# Altium schematic sheet Driver.SchDoc: Blood Flow Phantom
size A4; ApprovedBy: Sergei Vostrikov; CheckedBy: Sergei Vostrikov; Author: Ilia Nazemtsev; CompanyName: ETH Zurich; DrawnBy: Ilia Nazemtsev; Organization: Integrated Systems Laboratory; Address1: Gloriastrasse 35; Address2: 8092 Zurich; Address3: ETZ J69; Revision: 1.0; SheetNumber: 2; SheetTotal: 3; Laboratory: Integrated Systems Laboratory
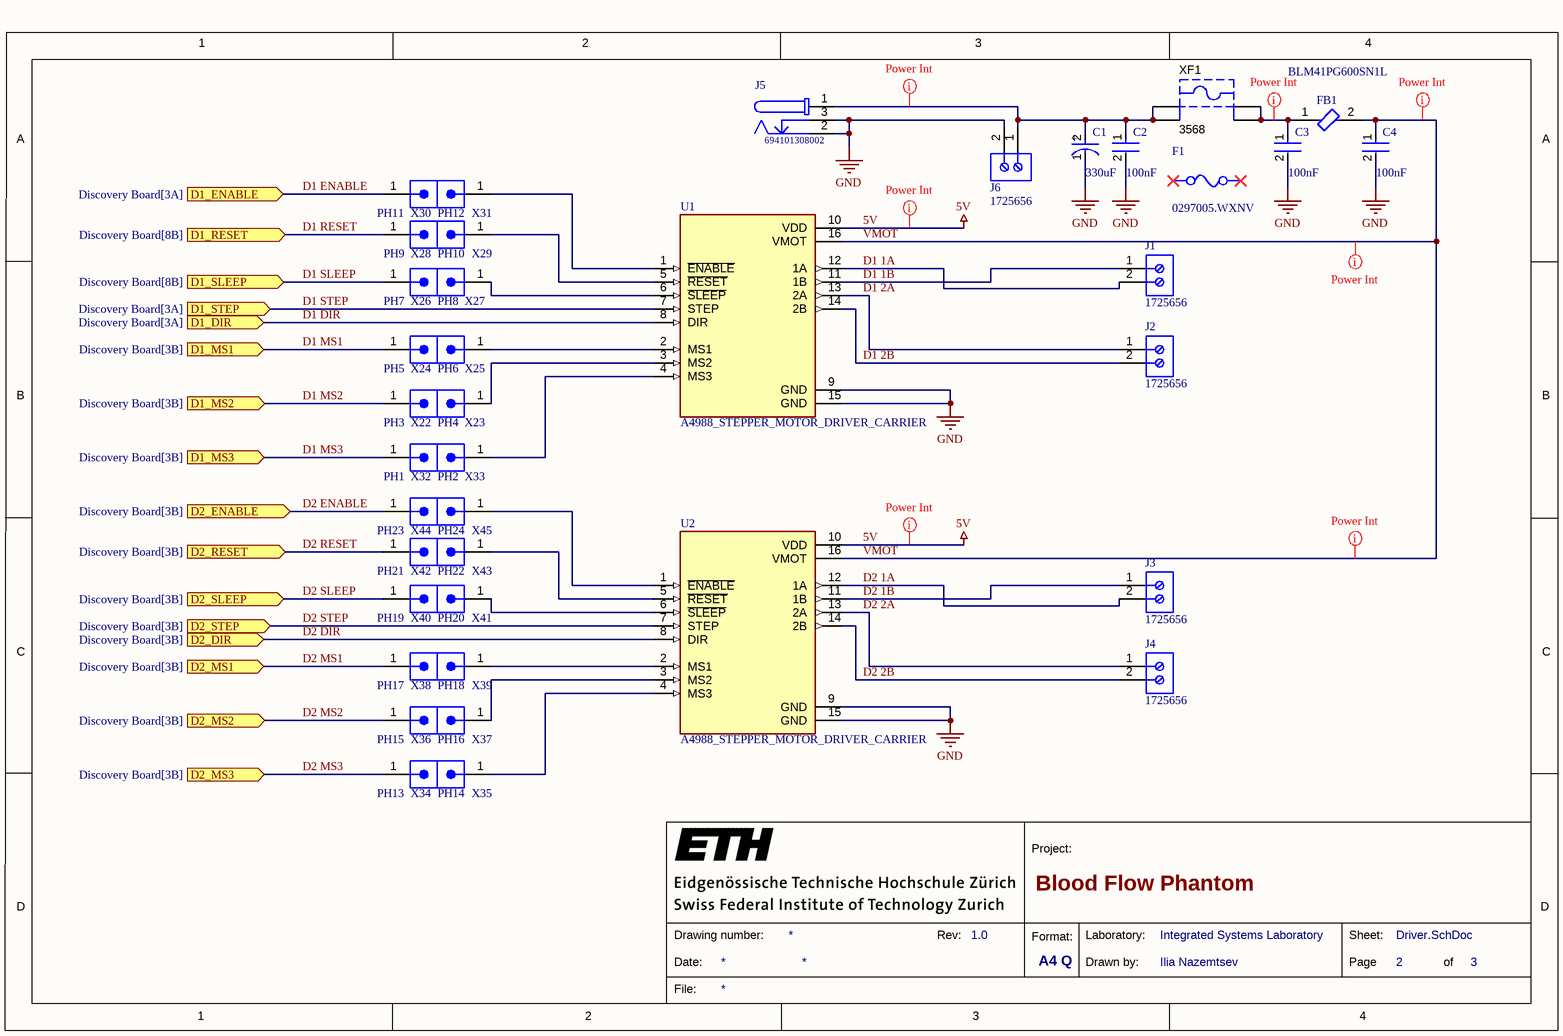
[diagram p0: Driver.SchDoc]

## Parts
C1  330uF  [FP-RAD-TH-D_10_0_5-L_12_5-MFG]
C2  100nF  [FP-CL31-IPC_C]
C3  100nF  [FP-CL31-IPC_C]
C4  100nF  [FP-CL31-IPC_C]
F1  0297005.WXNV  [FP-0297-MFG]
FB1  BLM41PG600SN1L  [FP-BLM41-0_2-IPC_B]
J1  1725656  [PHOE-1725656-2]
J2  1725656  [PHOE-1725656-2]
J3  1725656  [PHOE-1725656-2]
J4  1725656  [PHOE-1725656-2]
J5  694101308002  [694101308002]
J6  1725656  [PHOE-1725656-2]
U1  A4988_STEPPER_MOTOR_DRIVER_CARRIER  [MODULE_A4988_STEPPER_MOTOR_DRIVER_CARRIER]
U2  A4988_STEPPER_MOTOR_DRIVER_CARRIER  [MODULE_A4988_STEPPER_MOTOR_DRIVER_CARRIER]
X22  PH3  [68000-101HLF]
X23  PH4  [68000-101HLF]
X24  PH5  [68000-101HLF]
X25  PH6  [68000-101HLF]
X26  PH7  [68000-101HLF]
X27  PH8  [68000-101HLF]
X28  PH9  [68000-101HLF]
X29  PH10  [68000-101HLF]
X30  PH11  [68000-101HLF]
X31  PH12  [68000-101HLF]
X32  PH1  [68000-101HLF]
X33  PH2  [68000-101HLF]
X34  PH13  [68000-101HLF]
X35  PH14  [68000-101HLF]
X36  PH15  [68000-101HLF]
X37  PH16  [68000-101HLF]
X38  PH17  [68000-101HLF]
X39  PH18  [68000-101HLF]
X40  PH19  [68000-101HLF]
X41  PH20  [68000-101HLF]
X42  PH21  [68000-101HLF]
X43  PH22  [68000-101HLF]
X44  PH23  [68000-101HLF]
X45  PH24  [68000-101HLF]
XF1  3568  [KSTN-3568_V]

## Ports
D1_DIR (in, see Discovery Board[3A]), D1_ENABLE (in, see Discovery Board[3A]), D1_MS1 (in, see Discovery Board[3B]), D1_MS2 (in, see Discovery Board[3B]), D1_MS3 (in, see Discovery Board[3B]), D1_RESET (in, see Discovery Board[8B]), D1_SLEEP (in, see Discovery Board[8B]), D1_STEP (in, see Discovery Board[3A]), D2_DIR (in, see Discovery Board[3B]), D2_ENABLE (in, see Discovery Board[3B]), D2_MS1 (in, see Discovery Board[3B]), D2_MS2 (in, see Discovery Board[3B]), D2_MS3 (in, see Discovery Board[3B]), D2_RESET (in, see Discovery Board[3B]), D2_SLEEP (in, see Discovery Board[3B]), D2_STEP (in, see Discovery Board[3B])

## Nets
5V: U1.10(VDD) U2.10(VDD)
GND: C1.1(C) C2.2 C3.2 C4.2 J5.2 J5.3 J6.2 U1.9(GND) U1.15(GND) U2.9(GND) U2.15(GND)
D1 1A: J1.2 U1.12(1A)
D1 1B: J1.1 U1.11(1B)
D1 2A: J2.1 U1.13(2A)
D1 2B: J2.2 U1.14(2B)
D1 DIR: U1.8(DIR) ; port D1_DIR
D1 ENABLE: X30.1 ; port D1_ENABLE
D1 MS1: X24.1 ; port D1_MS1
D1 MS2: X22.1 ; port D1_MS2
D1 MS3: X32.1 ; port D1_MS3
D1 RESET: X28.1 ; port D1_RESET
D1 SLEEP: X26.1 ; port D1_SLEEP
D1 STEP: U1.7(STEP) ; port D1_STEP
D2 1A: J3.2 U2.12(1A)
D2 1B: J3.1 U2.11(1B)
D2 2A: J4.1 U2.13(2A)
D2 2B: J4.2 U2.14(2B)
D2 DIR: U2.8(DIR) ; port D2_DIR
D2 ENABLE: X44.1 ; port D2_ENABLE
D2 MS1: X38.1 ; port D2_MS1
D2 MS2: X36.1 ; port D2_MS2
D2 MS3: X34.1 ; port D2_MS3
D2 RESET: X42.1 ; port D2_RESET
D2 SLEEP: X40.1 ; port D2_SLEEP
D2 STEP: U2.7(STEP) ; port D2_STEP
VMOT: C4.1 FB1.2 U1.16(VMOT) U2.16(VMOT)
NetC1_2: C1.2(A) C2.1 J5.1 J6.1 XF1.1 XF1.2
NetC3_1: C3.1 FB1.1 XF1.3 XF1.4
NetU1_1: U1.1(~{ENABLE}) X31.1
NetU1_2: U1.2(MS1) X25.1
NetU1_3: U1.3(MS2) X23.1
NetU1_4: U1.4(MS3) X33.1
NetU1_5: U1.5(~{RESET}) X29.1
NetU1_6: U1.6(~{SLEEP}) X27.1
NetU2_1: U2.1(~{ENABLE}) X45.1
NetU2_2: U2.2(MS1) X39.1
NetU2_3: U2.3(MS2) X37.1
NetU2_4: U2.4(MS3) X35.1
NetU2_5: U2.5(~{RESET}) X43.1
NetU2_6: U2.6(~{SLEEP}) X41.1

## Layout directives
rule Width Constraint [Pref Width = 2mm    Min Width = 2mm    Max Width = 2mm]: NetC1_2, NetC3_1, VMOT
rule Width Constraint [Pref Width = 0.5mm    Min Width = 0.3mm    Max Width = 1mm]: 5V
rule Width Constraint [Pref Width = 1mm    Min Width = 1mm    Max Width = 1mm]: VMOT

## Notes on the sheet
- 1
- 2
- 3
- 4
- A
- B
- C
- Project:
- D
- Date:
- Drawing number:
- Rev:
- Format:
- A4 Q
- Drawn by:
- Laboratory:
- Page
- Sheet:
- of
- File:
- (in symbol CMP-05427-001459-1) +

## Library data of the parts
C1 = CMP-05427-001459-1: Aluminum Electrolytic Capacitors (Radial Lead Type) 330uF ±20% 35V; Lead Diameter: 0.6mm; Ripple Current (AC): 1.33A; Impedance: 43mR; Life (Hours): 6000Hour; Height: 12.5mm; Diameter: 10mm; Capacitance: 330uF; Voltage: 35V; Voltage Rating: 35V; RoHS Compliant: Yes; Series: FR Radial; REACH SVHC: No SVHC; Min Operating Temperature: -40°C; Tolerance: 20%; Termination: Radial; Ripple Current: 1.33A; Max Operating Temperature: 105°C; Lead Pitch: 5mm; Packaging: Bulk; Case/Package: Radial; Construction: RADIAL
C2-C4 = CMP-13271-001731-1: Cap Ceramic 100nF 50V X7R ±10% SMD 1206 +125°C Embossed T/R; Voltage: 50V; Thickness: 0.037inch; Lead Free: Lead Free; Length: 3.2mm; Min Operating Temperature: -55°C; Package Quantity: 15000; Packaging: Tape and Reel; Mount: Surface Mount; Depth: 1.6mm; Case/Package: 1206; Voltage Rating (DC): 50V; Tolerance: 10%; Height: 0.85mm; Capacitance: 100nF; Radiation Hardening: No; Dielectric: X7R; Voltage Rating: 50V; Max Operating Temperature: 125°C; Width: 0.063inch
F1 = CMP-08605-000073-1: FUSE AUTO 5A 32VDC BLADE MINI; Manufacturer: Littelfuse Inc; Fuse Interrupt Dc Current: 1000A; Fuse Blow Speed: Fast; Fuse Voltage Drop: 129mV; Value: 17.75mΩ; Voltage Rating: 32V; Fuse I2T: 25A2Sec; Category: Fuse; Temperature: -40°C to +125°C; Manufacturer Part Number: 0297005.WXNV; Digikey Description: FUSE AUTO 5A 32VDC BLADE MINI; Lead Free: Yes; Temperature Range High: +125°C; Package: 0297; ComponentLink2Description: Datasheet; Octopart: https://octopart.com/0297005.wxnv-littelfuse-566870; Fuse Current: 5A; Temperature Range Low: -40°C; Mouser Description: Automotive Fuses 32V 5A Mini; RoHS: TRUE; Device Class L1: Circuit Protection; Resistance: 17.75mΩ; Automotive: Yes; Device Class L2: Fuses; Device Class L3: unset; ComponentLink2URL: https://www.littelfuse.com/~/media/automotive/datasheets/fuses/passenger-car-and-commercial-vehicle/blade-fuses/littelfuse_mini_datasheet.pdf; Max Fuse Dc Voltage: 32V
FB1 = CMP-0686-00754-3: Ferrite Bead, 1806, 60Ω @ 100MHz, 0.009Ω, 6A; Manufacturer Series: BLM41P; Tolerance: 25%; Number of Lines: 1; Shielding: Unshielded; Impedance: 60R; DC Resistance-Max: 9mR; Test Frequency: 100MHz; Case Code (Imperial): 1806; Height: 1.6mm; REACH SVHC: No SVHC; Radiation Hardening: No; Core Material: Ferrite; Case Code (Metric): 4516; Frequency: 100MHz; Number of Circuits: 1; Termination: SMD/SMT; Contact Plating: Tin; Width: 1.6mm; Number of Pins: 2; Package Quantity: 1; Series: BLM41P; Max DC Current: 6A; Inductor Type: FERRITE BEAD; Case/Package: 1806; DC Current: 6A; Number of Functions: 1; Length: 4.5mm; DC Resistance (DCR): 9mR; Terminal Finish: Tin; Military Standard: Not; Min Operating Temperature: -55°C; Depth: 1.6mm; Lead Free: Lead Free; Current: 6A; RoHS Compliant: Yes; Max Current Rating: 6A; Current Rating: 6A; Max Operating Temperature: 125°C; Packaging: Tape and Reel; Material: Ferrite
J1-J4 J6 = CMP-2000-05299-1: Male Header, Pitch 2.54 mm, 1 x 2 Position, Height 9 mm, Tail Length 3.5 mm; Manufacturer: Phoenix Contact; Number of contacts: 2; Content: 250pc(s); Pitch: 2.54mm; Industrial packaging: Yes; Colour: Green; Manufacturer part No.: 1725656; Type: MPT0,5/2-2,54; Datasheet URL: http://datasheet.octopart.com/1725656-Phoenix-Contact-datasheet-5302866.pdf; Manufacturer URL: http://www.phoenixcontact.com/; Datasheet Version: Apr-08
J5 = CMP-1502-00182-1: DC Power Jack Connector Low Profile WR-DC, Male, Right Angled, THT, 2 A, 12 V; Manufacturer: Wurth Elektronik; Opening Diameter: 2.8mm; Rated Current: 2A; Plug Inner Diameter: 0.75mm; Working Voltage: 12V; Plug Outer Diameter: 2.35mm; Part Number: 694101308002; Packaging: Bag; Mounting Technology: THT; Orientation: RightAngled; Package Reference: 694101308002; Datasheet URL: http://katalog.we-online.de/em/datasheet/694101308002.pdf; Publisher: WurthElektronik; Manufacturer URL: http://www.we-online.de; Gender: Male; Operating Temperature: -40to85degC
U1 U2 = A4988_STEPPER_MOTOR_DRIVER_CARRIER: Stepper motor controler; IC: A4988; 1A; Uin mot: 8Ã·35V; Price: None; Value: *; MP: A4988_STEPPER_MOTOR_DRIVER_CARRIER; Package: None; Availability: Unavailable
X22-X45 = CMP-00008-5: 1 Positions Header, Unshrouded Connector  Through Hole Gold or Gold, GXT™; Manufacturer: Amphenol FCI; Pitch: 2.54mm; Gender: Male; Number of Positions: 1; Connector Type: Male Pin; Current Rating: 3A; Voltage Rating: 1.5kV; Insulation Resistance: 5GR; Mating Post Length: 5.84mm; Value: 1000Meg; Packaging: Bulk; Supplier: Digikey; Supplier Part Number: 609-3460-ND; ComponentLink1Description: 68000-274334-5147816.pdf; ComponentLink1URL: https://datasheet.ciiva.com/5147/68000-274334-5147816.pdf; Orientation: Straight; ComponentLink2Description: 70236886-14643004.pdf; ComponentLink3URL: https://datasheet.ciiva.com/10150/68000-10150538.pdf; ComponentLink3Description: 68000-10150538.pdf; ComponentLink2URL: https://datasheet.ciiva.com/14643/70236886-14643004.pdf; Manufacturer Part Number: 68000-101HLF; Number of Rows: 1; Termination: Solder; Contact Material: Bronze; Contact Mating Length: 0.23inch; Length: 2.54mm; Housing Material: Thermoplastic; Number of Contacts: 1; Min Operating Temperature: -65°C; Max Operating Temperature: 125°C; Package Quantity: 100; Radiation Hardening: No; ComponentLink4Description: 68000-731073.pdf; ComponentLink4URL: https://datasheet.ciiva.com/731/68000-731073.pdf; Colour: Black; Contact Plating: Nickel,Gold,GXT; Depth: 2.41mm; Flammability Rating: UL94 V-0; Voltage Rating (DC): 1.5kV; Housing Colour: Black; Max Voltage Rating (AC): 1.5kV; Contact Gender: Male; Termination Post Length: 2.41mm
XF1 = CMP-2000-05464-1: Fuse Holder, 20 A, 500 V, -50 to 145 degC, 4-Pin THD, RoHS; Manufacturer: Keystone; Package Reference: 3568; Datasheet Version: 04/2013; Datasheet URL: https://datasheet.ciiva.com/16294/m60-2p40-16294706.pdf; Manufacturer URL: http://www.keyelco.com/; Mounting Technology: ThroughHole; Package Description: 4-Pin Through Hole Device, Body 16 x 6.73 mm, Pitch 9.9 mm